# EAGLE design mapleSDuino-Large-V0.1_005 (EAGLE 9.5.1)
MAPLE-CUx Large Version
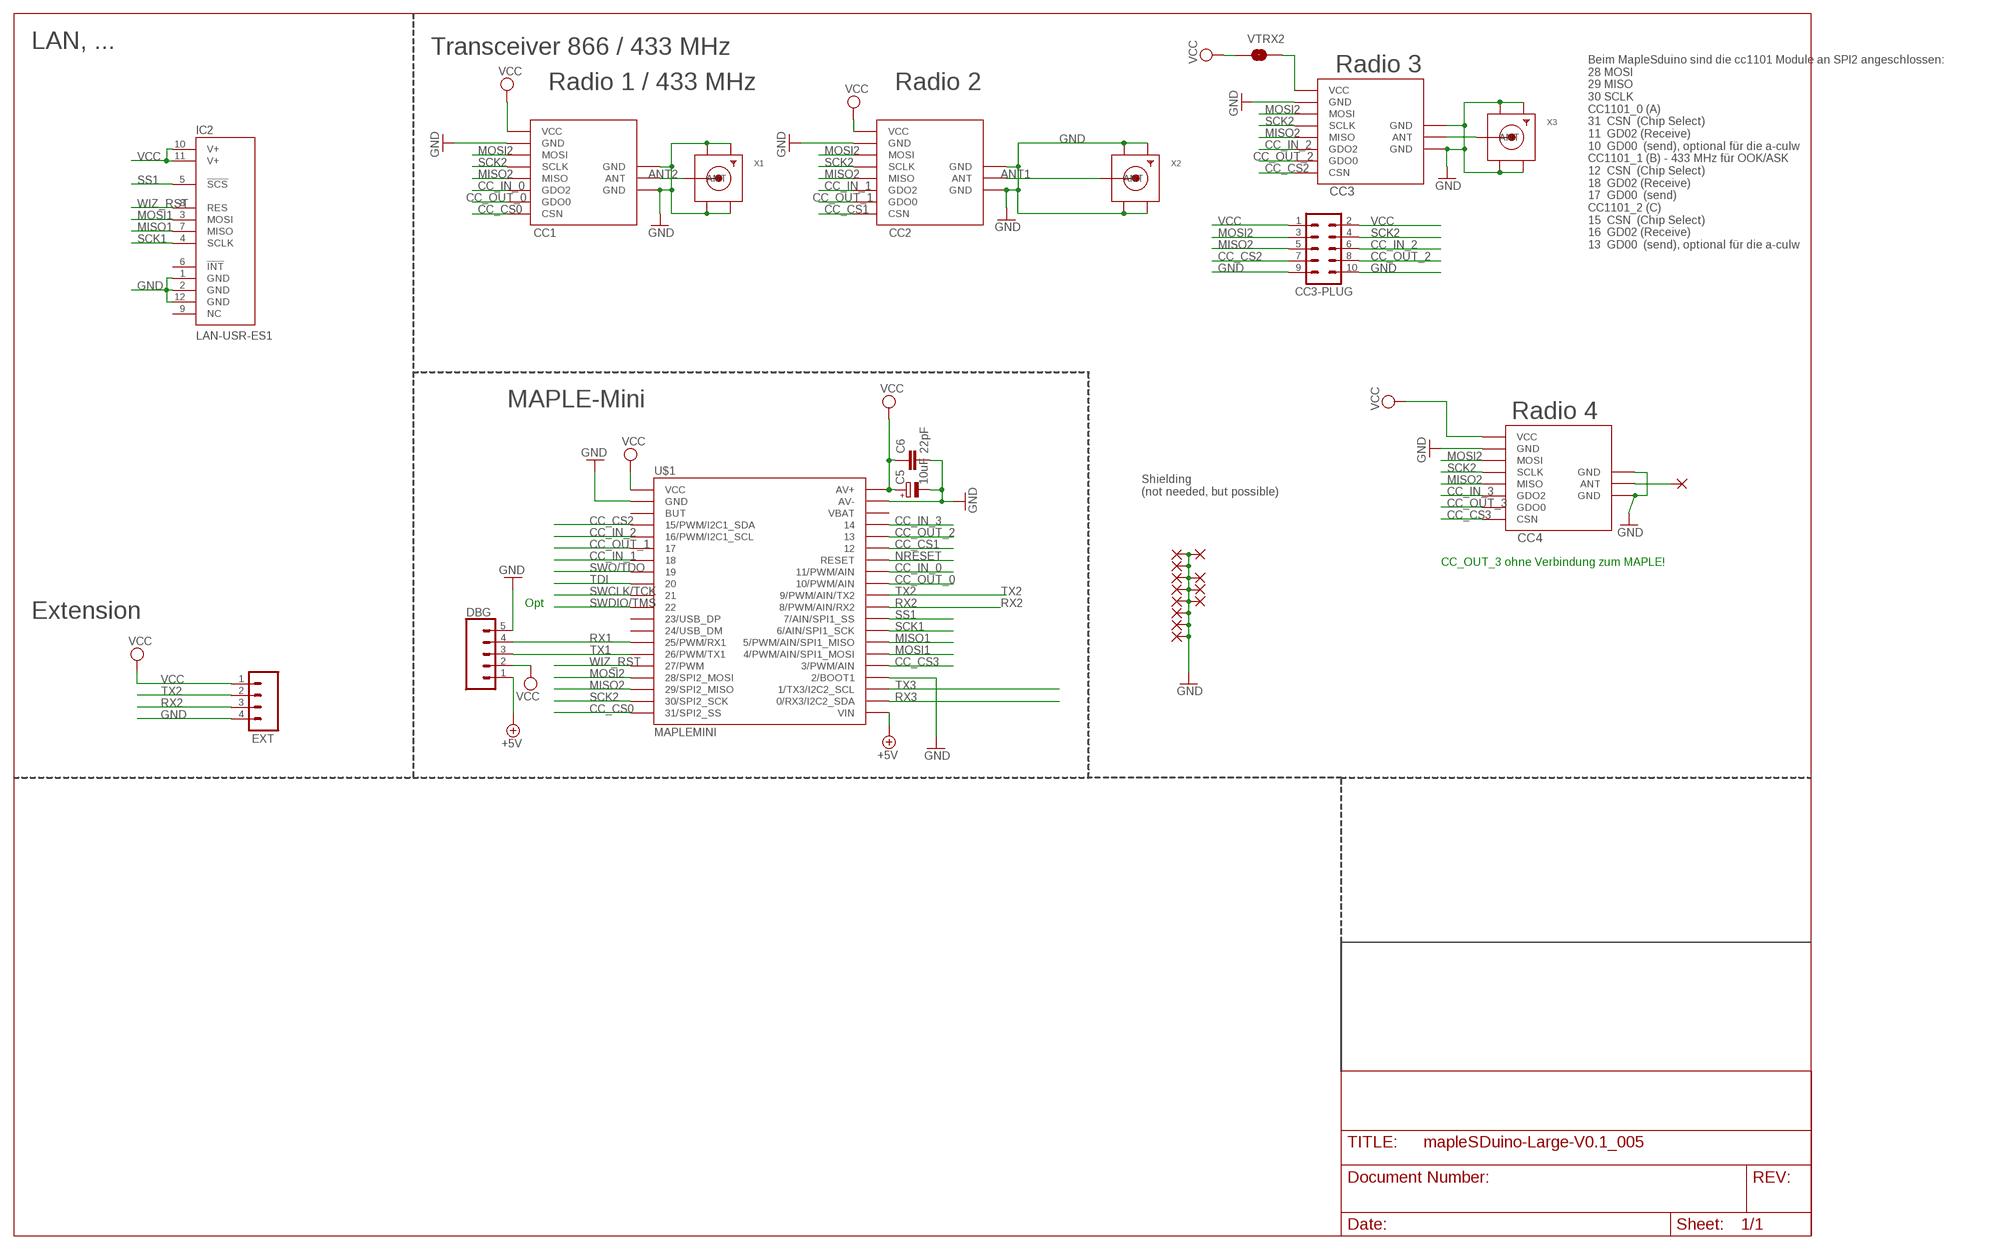
[diagram p0: schematic, sheet 1]

## Parts
C5  10uF  CPOL-EUR/2012-12W  [R/2012-12W]
C6  22pF  C-EUC0805  [C0805]
CC1  CC1101  CC1101_MODULE1SMD  [CC1101_MODULE1_SMD]
CC2  CC1101_MODULE1SMD  [CC1101_MODULE1_SMD]
CC3  CC1101_MODULE1SMD  [CC1101_MODULE1_SMD]
CC3-PLUG  MA05-2  [MA05-2]
CC4  CC1101_MODULE1SMD  [CC1101_MODULE1_SMD]
DBG  CONN_05LOCK  [1X05_LOCK]
EXT  CONN_04PTH  [1X04]
IC2  LAN-USR-ES1  [USR-ES1]
PAD1  WIREPADSMD1,27-254  [SMD1,27-2,54]
PAD2  WIREPADSMD1,27-254  [SMD1,27-2,54]
PAD3  WIREPADSMD1,27-254  [SMD1,27-2,54]
PAD4  WIREPADSMD1,27-254  [SMD1,27-2,54]
PAD5  WIREPADSMD1,27-254  [SMD1,27-2,54]
PAD6  WIREPADSMD1,27-254  [SMD1,27-2,54]
PAD7  WIREPADSMD1,27-254  [SMD1,27-2,54]
PAD8  WIREPADSMD1,27-254  [SMD1,27-2,54]
PAD9  WIREPADSMD1,27-254  [SMD1,27-2,54]
PAD10  WIREPADSMD1,27-254  [SMD1,27-2,54]
PAD11  WIREPADSMD1,27-254  [SMD1,27-2,54]
PAD12  WIREPADSMD1,27-254  [SMD1,27-2,54]
PAD13  WIREPADSMD1,27-254  [SMD1,27-2,54]
U$1  MAPLEMINI  [20-DIP]
VTRX2  JUMPER-SMT_2_NC_TRACE_SILK  [SMT-JUMPER_2_NC_TRACE_SILK]
X1  SMACONNECTOR_EDGE  [SMA_EDGELAUNCH]
X2  SMACONNECTOR_EDGE  [SMA_EDGELAUNCH]
X3  SMACONNECTOR_EDGE  [SMA_EDGELAUNCH]

## Nets
+5V [PWR]: DBG.1 U$1.21(VIN)
ANT1 [PWR]: CC2.ANT X2.P(ANT)
ANT2: CC1.ANT X1.P(ANT)
ANT3: CC3.ANT X3.P(ANT)
CC_CS0: CC1.CSN U$1.20(31/SPI2_SS)
CC_CS1: CC2.CSN U$1.35
CC_CS2: CC3-PLUG.7 CC3.CSN U$1.4(15/PWM/I2C1_SDA)
CC_CS3: CC4.CSN U$1.25(3/PWM/AIN)
CC_IN_0: CC1.GDO2 U$1.33(11/PWM/AIN)
CC_IN_1: CC2.GDO2 U$1.7
CC_IN_2: CC3-PLUG.6 CC3.GDO2 U$1.5(16/PWM/I2C1_SCL)
CC_IN_3: CC4.GDO2 U$1.37
CC_OUT_0: CC1.GDO0 U$1.32(10/PWM/AIN)
CC_OUT_1: CC2.GDO0 U$1.6
CC_OUT_2: CC3-PLUG.8 CC3.GDO0 U$1.36
CC_OUT_3: CC4.GDO0
GND [PWR]: C5.- C6.2 CC1.GND@0(GND) CC1.GND@1(GND) CC1.GND@2(GND) CC2.GND@0(GND) CC2.GND@1(GND) CC2.GND@2(GND) CC3-PLUG.9 CC3-PLUG.10 CC3.GND@0(GND) CC3.GND@1(GND) CC3.GND@2(GND) CC4.GND@0(GND) CC4.GND@1(GND) CC4.GND@2(GND) DBG.5 EXT.4 IC2.1(GND) IC2.2(GND) IC2.12(GND) PAD1.1(P) PAD2.1(P) PAD3.1(P) PAD4.1(P) PAD5.1(P) PAD6.1(P) PAD7.1(P) PAD8.1(P) PAD9.1(P) PAD10.1(P) PAD11.1(P) PAD12.1(P) U$1.2(GND) U$1.24(2/BOOT1) U$1.39(AV-) X1.GND@1(GND4) X1.GND@2(GND3) X1.GND@3(GND2) X1.GND@4(GND1) X2.GND@1(GND4) X2.GND@2(GND3) X2.GND@3(GND2) X2.GND@4(GND1) X3.GND@1(GND4) X3.GND@2(GND3) X3.GND@3(GND2) X3.GND@4(GND1)
MISO1: IC2.7(MISO) U$1.27(5/PWM/AIN/SPI1_MISO)
MISO2: CC1.MISO CC2.MISO CC3-PLUG.5 CC3.MISO CC4.MISO U$1.18(29/SPI2_MISO)
MOSI1: IC2.3(MOSI) U$1.26(4/PWM/AIN/SPI1_MOSI)
MOSI2: CC1.MOSI CC2.MOSI CC3-PLUG.3 CC3.MOSI CC4.MOSI U$1.17(28/SPI2_MOSI)
N$1 [PWR]: CC3.VCC VTRX2.2
N$2: CC4.ANT PAD13.1(P)
NRESET: U$1.34(RESET)
RX1: DBG.4 U$1.14(25/PWM/RX1)
RX2: EXT.3 U$1.30(8/PWM/AIN/RX2)
RX3: U$1.22(0/RX3/I2C2_SDA)
SCK1: IC2.4(SCLK) U$1.28(6/AIN/SPI1_SCK)
SCK2: CC1.SCLK CC2.SCLK CC3-PLUG.4 CC3.SCLK CC4.SCLK U$1.19(30/SPI2_SCK)
SS1: IC2.5(!SCS!) U$1.29(7/AIN/SPI1_SS)
SWCLK/TCK: U$1.10
SWDIO/TMS: U$1.11
SWO/TDO: U$1.8
TDI: U$1.9
TX1: DBG.3 U$1.15(26/PWM/TX1)
TX2: EXT.2 U$1.31(9/PWM/AIN/TX2)
TX3: U$1.23(1/TX3/I2C2_SCL)
VCC [PWR]: C5.+ C6.1 CC1.VCC CC2.VCC CC3-PLUG.1 CC3-PLUG.2 CC4.VCC DBG.2 EXT.1 IC2.10(V+) IC2.11(V+) U$1.1(VCC) U$1.40(AV+) VTRX2.1
WIZ_RST: IC2.8(RES) U$1.16(27/PWM)
Unconnected: IC2.6(!INT!) IC2.9(NC) U$1.3(BUT) U$1.12(23/USB_DP) U$1.13(24/USB_DM) U$1.38(VBAT)

## Notes on the sheet
- LAN, ... | Transceiver 866 / 433 MHz
- Radio 3
- Radio 1 / 433 MHz | Radio 2
- Beim MapleSduino sind die cc1101 Module an SPI2 angeschlossen:
  28 MOSI
  29 MISO
  30 SCLK
  CC1101_0 (A)
  31  CSN  (Chip Select)
  11  GD02 (Receive)
  10  GD00  (send), optional für die a-culw
  CC1101_1 (B) - 433 MHz für OOK/ASK
  12  CSN  (Chip Select)
  18  GD02 (Receive)
  17  GD00  (send)
  CC1101_2 (C)
  15  CSN  (Chip Select)
  16  GD02 (Receive)
  13  GD00  (send), optional für die a-culw
- MAPLE-Mini
- Radio 4
- Shielding
  (not needed, but possible)
- CC_OUT_3 ohne Verbindung zum MAPLE!
- Opt
- Extension

## Library data of the parts
C5 = rcl:CPOL-EU: POLARIZED CAPACITOR, European symbol
C6 = rcl:C-EU: CAPACITOR, European symbol
CC1 CC2 = CC1101:CC1101_MODULE1: CC1101 wireless module for 433/868 MHz (sold from Aliexpress). DIL version for mounting with pin header (and SMD soldering) and SMD only variant available.
CC3 CC4 = wireless:CC1101_MODULE1: CC1101 wireless module for 433/868 MHz (sold from Aliexpress). DIL version for mounting with pin header (and SMD soldering) and SMD only variant available.
CC3-PLUG = con-lstb:MA05-2: PIN HEADER; OC_FARNELL: unknown; OC_NEWARK: unknown
DBG = SparkFun-Connectors:CONN_05: Multi connection point. Often used as Generic Header-pin footprint for 0.1 inch spaced/style header connections On any of the 0.1 inch spaced packages, you can populate with these: Break Away Headers - Straight <https://www.sparkfun.com/products/116> (PRT-00116) Break Away Male Headers - Right Angle <https://www.sparkfun.com/products/553> (PRT-00553) Female Headers <https://www.sparkfun.com/products/115> (PRT-00115) Break Away Headers - Machine Pin <https://www.sparkfun.com/products/117> (PRT-00117) Break Away Female Headers - Swiss Machine Pin <https://www.sparkfun.com/products/743> (PRT-00743) For SCREWTERMINALS and SPRING TERMINALS visit here: Screw Terimnals on SparkFun.com <https://www.sparkfun.com/search/results?term=Screw+Terminals> (5mm/3.5mm/2.54mm spacing) This device is also useful as a general connection point to wire up your design to another part of your project. Our various solder wires solder well into these plated through hole pads. Hook-Up Wire - Assortment (Stranded, 22 AWG) <https://www.sparkfun.com/products/11375> (PRT-11375) Hook-Up Wire - Assortment (Solid Core, 22 AWG) <https://www.sparkfun.com/products/11367> (PRT-11367) View the entire wire category on our website here <https://www.sparkfun.com/categories/141> Special notes: Molex polarized connector foot print use with SKU : PRT-08231 with associated crimp pins and housings. 1MM SMD Version SKU: PRT-10208
EXT = SparkFun-Connectors:CONN_04: Multi connection point. Often used as Generic Header-pin footprint for 0.1 inch spaced/style header connections On any of the 0.1 inch spaced packages, you can populate with these: Break Away Headers - Straight <https://www.sparkfun.com/products/116> (PRT-00116) Break Away Male Headers - Right Angle <https://www.sparkfun.com/products/553> (PRT-00553) Female Headers <https://www.sparkfun.com/products/115> (PRT-00115) Break Away Headers - Machine Pin <https://www.sparkfun.com/products/117> (PRT-00117) Break Away Female Headers - Swiss Machine Pin <https://www.sparkfun.com/products/743> (PRT-00743) For SCREWTERMINALS and SPRING TERMINALS visit here: Screw Terimnals on SparkFun.com <https://www.sparkfun.com/search/results?term=Screw+Terminals> (5mm/3.5mm/2.54mm spacing) This device is also useful as a general connection point to wire up your design to another part of your project. Our various solder wires solder well into these plated through hole pads. Hook-Up Wire - Assortment (Stranded, 22 AWG) <https://www.sparkfun.com/products/11375> (PRT-11375) Hook-Up Wire - Assortment (Solid Core, 22 AWG) <https://www.sparkfun.com/products/11367> (PRT-11367) View the entire wire category on our website here <https://www.sparkfun.com/categories/141> Special notes: Molex polarized connector foot print use with SKU : PRT-08231 with associated crimp pins and housings. 1MM SMD Version SKU: PRT-10208; PROD_ID: CONN-09696
IC2 = Martin-Communication:LAN-USR-ES1
PAD1-PAD13 = wirepad:WIREPAD: Wire PAD connect wire on PCB
U$1 = maplemini-small:MAPLEMINI
VTRX2 = SparkFun-Jumpers:JUMPER-SMT_2_NC_TRACE: Normally closed trace jumper This jumper has a trace between two pads so it's normally closed (NC). Use a razor knife to open the connection. For best results follow the IPC guidelines for cutting traces: Cutout at least 0.063 mm (0.005 in). Remove all loose material to clean up the cut area. Seal the cut with an approved epoxy. Reapply solder to reclose the connection.
X1-X3 = adafruit:SMACONNECTOR: SMA Connector 90° DIP SMA Connector, 50 Ohm (4UConnector: 07259)

## Net classes
0 default: width 0.305 mm
1 PWR: width 0.406 mm

## Board
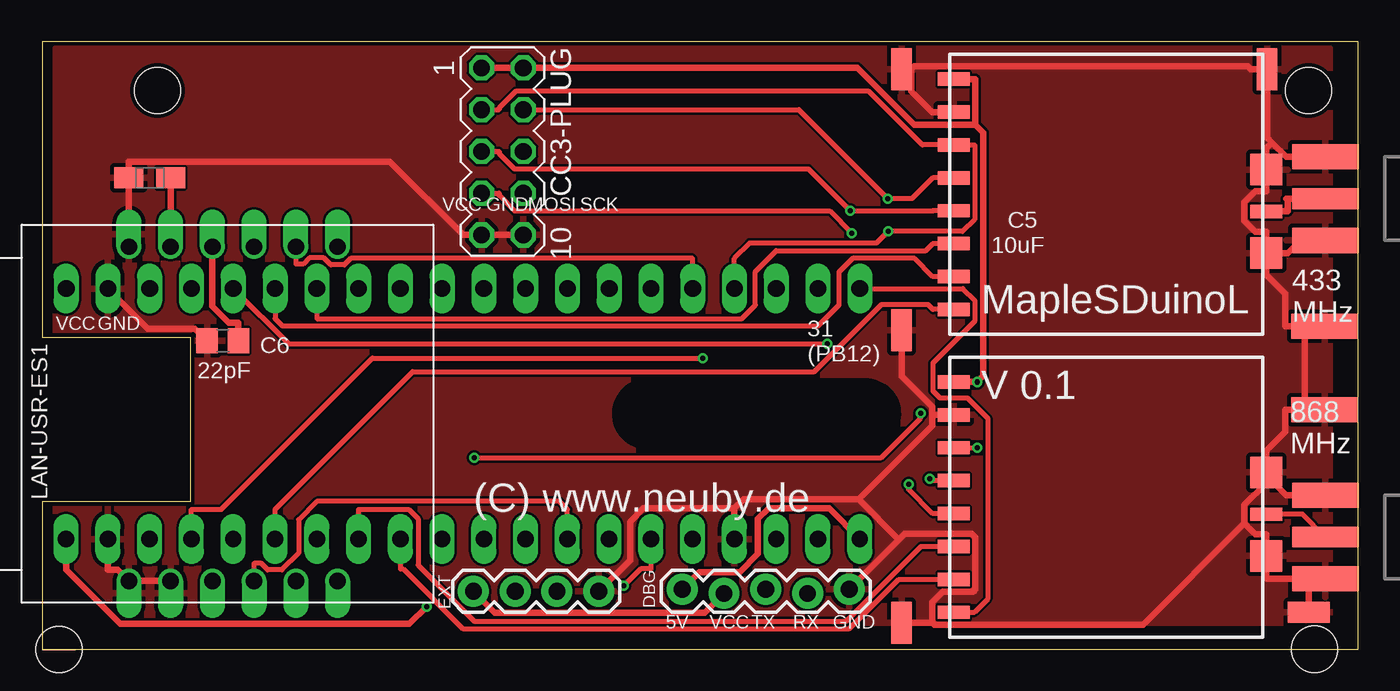
[diagram p1: board, top side]
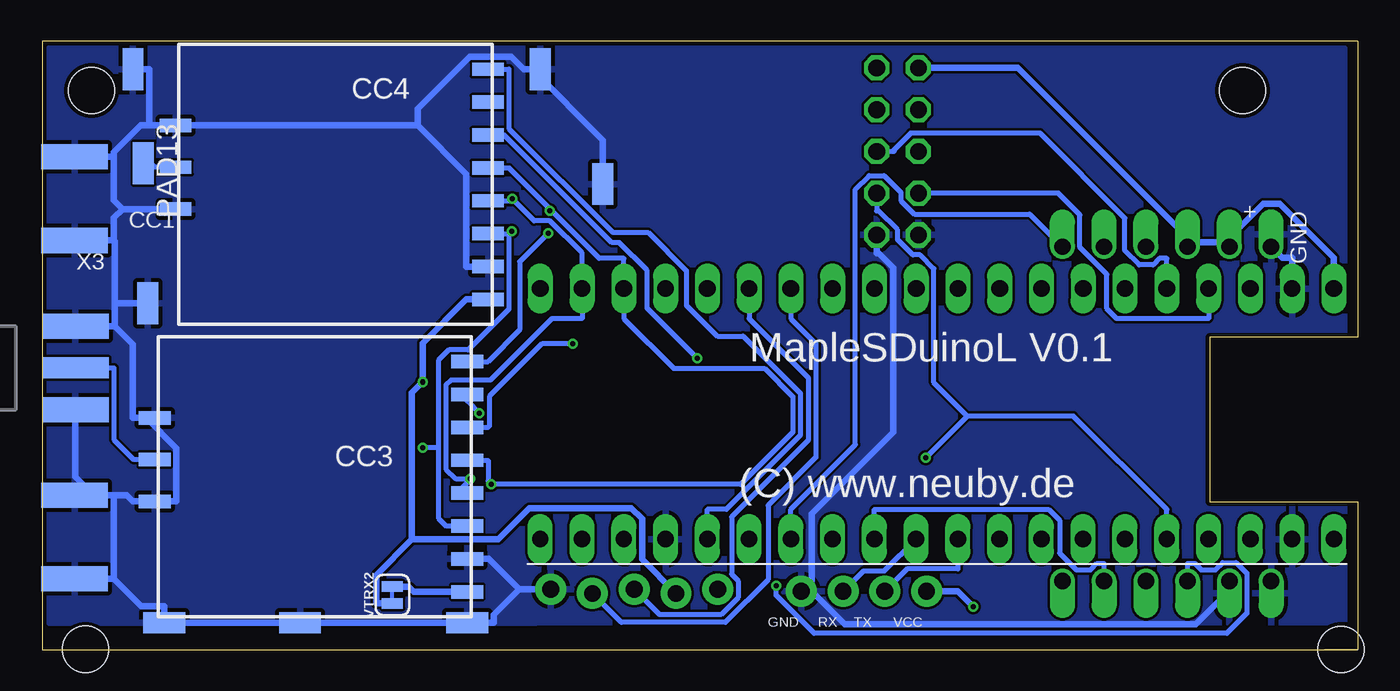
[diagram p2: board, bottom side, seen from below]

Size 80 x 37 mm. Coordinates in mm from the lower left corner, seen from the top.
Outline: 2,0 80,0 80,37 0,37 0,19 9,19 9,9 0,9 0,0
Outline: 2,0 1,0 0,0
Outline: 0,0 2,0
Copper layers (1*16): Top 0.035mm / dielectric 1.5mm / Bottom 0.035mm
Design rules "Fusion_eagle_rule_v1.1": minimum track width 6mil, minimum drill 12mil, track to track 6mil, track to pad 6mil, pad to pad 6mil, via to via 6mil, smd to smd 0mil, copper to edge 10mil, drill to drill 10mil, minimum pad ring 10mil, minimum via ring 6mil, stop-mask expansion 2mil, vias tented up to drill 100mil, thermal gap 10mil
Holes 2.8 mm at 1,0 77,34 77.35,0.02 7,34
tRestrict: 8 lines
bRestrict: 6 lines

### Footprints (pad centres in the part's own frame; a part is rotated, then mirrored left to right if it is on the bottom)
R/2012-12W = smd 1.75 x 1.26: + 1.275,0; - -1.275,0
C0805 = smd 1.3 x 1.5: 1 -0.95,0; 2 0.95,0
CC1101_MODULE1_SMD = smd 1.93 x 0.813: ANT 19,5.96; CSN 0,0; GDO0 0,2; GDO2 0,4; GND@0 0,12; MISO 0,6; MOSI 0,10; SCLK 0,8; VCC 0,14 | smd 1.93 x 1.905: GND@1 19,8.5; GND@2 19,3.42
CC1101_MODULE1_SMD' = smd 1.93 x 0.813: ANT 19,5.96; CSN 0,0; GDO0 0,2; GDO2 0,4; GND@0 0,12; GND@1 19,8.5; GND@2 19,3.42; MISO 0,6; MOSI 0,10; SCLK 0,8; VCC 0,14
MA05-2 = drill 1.016 octagon: 1 -5.08,-1.27; 2 -5.08,1.27; 3 -2.54,-1.27; 4 -2.54,1.27; 5 0,-1.27; 6 0,1.27; 7 2.54,-1.27; 8 2.54,1.27; 9 5.08,-1.27; 10 5.08,1.27
1X05_LOCK = drill 1.016 pad 1.88: 1 0,0.127; 2 2.54,-0.127; 3 5.08,0.127; 4 7.62,-0.127; 5 10.16,0.127
1X04 = drill 1.016 pad 1.88: 1 0,0; 2 2.54,0; 3 5.08,0; 4 7.62,0
USR-ES1 = drill 1 pad 1.35 offset: 1 -10.16,5.715; 2 -10.16,3.175; 3 -10.16,0.635; 4 -10.16,-1.905; 5 -10.16,-4.445; 6 -10.16,-6.985; 7 10.16,-6.985; 8 10.16,-4.445; 9 10.16,-1.905; 10 10.16,0.635; 11 10.16,3.175; 12 10.16,5.715
SMD1,27-2,54 = smd 1.27 x 2.54: 1 0,0
20-DIP = drill 1.016 pad 1.27 long: 1 -24.13,-7.62; 2 -21.59,-7.62; 3 -19.05,-7.62; 4 -16.51,-7.62; 5 -13.97,-7.62; 6 -11.43,-7.62; 7 -8.89,-7.62; 8 -6.35,-7.62; 9 -3.81,-7.62; 10 -1.27,-7.62; 11 1.27,-7.62; 12 3.81,-7.62; 13 6.35,-7.62; 14 8.89,-7.62; 15 11.43,-7.62; 16 13.97,-7.62; 17 16.51,-7.62; 18 19.05,-7.62; 19 21.59,-7.62; 20 24.13,-7.62 | drill 1 pad 1.27 long: 21 24.13,7.62; 22 21.59,7.62; 23 19.05,7.62; 24 16.51,7.62; 25 13.97,7.62; 26 11.43,7.62; 27 8.89,7.62; 28 6.35,7.62; 29 3.81,7.62; 30 1.27,7.62; 31 -1.27,7.62; 32 -3.81,7.62; 33 -6.35,7.62; 34 -8.89,7.62; 35 -11.43,7.62; 36 -13.97,7.62; 37 -16.51,7.62; 38 -19.05,7.62; 39 -21.59,7.62; 40 -24.13,7.62
SMT-JUMPER_2_NC_TRACE_SILK = smd 0.635 x 1.27: 1 -0.508,0; 2 0.508,0
SMA_EDGELAUNCH = smd 4.064 x 1.524: GND@1 2.032,-2.54; GND@2 2.032,2.54 | smd 4.064 x 1.524 bottom: GND@3 2.032,2.54; GND@4 2.032,-2.54 | smd 4.064 x 1.27: P 2.032,0

### Placement (x,y rotation side)
C5  6.53,28.69 0 top
C6  10.97,18.78 180 top
CC1  55.42,2.27 0 top
CC2  55.42,20.68 0 top
CC3  CC1101_MODULE1SMD  [CC1101_MODULE1_SMD']  54.15,17.51 180 bottom
CC3-PLUG  27.98,30.29 270 top
CC4  CC1101_MODULE1SMD  [CC1101_MODULE1_SMD']  52.88,35.29 180 bottom
DBG  38.91,3.54 0 top
EXT  26.21,3.54 0 top
IC2  10.97,14.34 90 top
PAD1  52.24,19.41 0 top
PAD2  77.01,2.27 90 top
PAD3  52.24,35.29 180 top
PAD4  72.56,1.64 270 bottom
PAD5  74.47,35.29 180 top
PAD6  52.24,1.64 0 top
PAD7  64.31,1.64 270 bottom
PAD8  54.15,1.64 270 bottom
PAD9  73.58,21.07 180 bottom
PAD10  74.47,35.29 0 bottom
PAD11  45.9,28.3 180 bottom
PAD12  49.7,35.29 180 bottom
PAD13  73.83,29.57 180 bottom
U$1  25.57,14.34 180 bottom
VTRX2  58.7,3.32 90 bottom
X1  80.06,6.84 180 top
X2  80.06,27.42 180 top
X3  80,17.13 0 bottom

### Tracks (layer width: path | path; a pad name or v marks a point on that pad's centre or on a via)
+5V
  Top 0.406: U$1.21 47.84,8.58 44.16,8.58 43.52,7.94 43.52,5.82 42.4,4.71 39.95,4.71 DBG.1
ANT1
  Top 0.406: CC2.ANT 75.74,26.64 75.74,27.31 75.64,27.42 X2.P
ANT2
  Top 0.305: X1.P 76.64,8.23 CC1.ANT
ANT3
  Bottom 0.305: CC3.ANT 74.42,11.55 75.63,12.76 75.63,17.13 X3.P
CC_CS0
  Top 0.305: CC1.CSN 56.69,2.27 57.48,3.06 57.48,14.07 56.25,15.31 54.58,15.31 54.15,15.74 54.15,17.41 56.69,19.95 56.69,21.25 55.98,21.95 U$1.20
CC_CS1
  Top 0.305: CC2.CSN 54.15,20.68 53.84,20.99 51.03,20.99 46.94,16.9 22.52,16.9 14.14,8.53 U$1.35
CC_CS2  (via drill 0.3 pad 0.61)
  Top 0.305: CC3-PLUG.7 27.77,27.75 27.77,27.62 28.71,26.68 47.87,26.68 v49.23,25.32
  Bottom 0.305: v49.23,25.32 50.96,23.59 50.96,19.43 52.88,17.51 CC3.CSN | U$1.4 9.06,20.13 14.65,20.13 15.25,20.73 15.25,22.82 16.89,24.45 16.89,26.44 18.2,27.75 CC3-PLUG.7
CC_CS3
  Bottom 0.305: U$1.25 39.55,8.53 38.38,8.53 33.88,13.03 33.88,15.57 37.36,19.06 38.94,19.06 40.81,20.94 40.81,23.04 43.14,25.36 45.29,25.36 51.61,31.68 51.61,35.29 CC4.CSN
CC_IN_0
  Top 0.305: U$1.33 19.23,8.53 22.27,8.53 22.85,7.95 22.85,5.13 26.26,1.73 48.89,1.73 53.43,6.27 CC1.GDO2
CC_IN_1
  Top 0.305: CC2.GDO2 54.15,24.68 53.72,24.25 44.63,24.25 43.35,22.98 43.35,20.94 42.54,20.13 16.68,20.13 U$1.7
CC_IN_2  (via drill 0.3 pad 0.61)
  Top 0.305: U$1.5 14.98,18.58 v47.73,18.58
  Bottom 0.305: v47.73,18.58 49.6,18.58 52.79,15.39 52.79,13.6 52.88,13.51 CC3.GDO2 | CC3-PLUG.6 28.18,30.29 28.18,30.4 27.18,31.4 19.3,31.4 14.14,26.24 14.14,24.25 13.29,23.39 12.44,23.39 12.05,23.78 11.61,23.78 U$1.5
CC_IN_3  (via drill 0.3 pad 0.61)
  Top 0.305: v40.16,17.72 20.07,17.72 10.88,8.53 9.06,8.53 U$1.37
  Bottom 0.305: v40.16,17.72 43.2,20.76 43.2,23.06 44.89,24.74 45.34,24.74 51.89,31.29 CC4.GDO2
CC_OUT_0
  Top 0.305: CC1.GDO0 52.08,4.27 49.08,1.27 25.57,1.27 21.93,4.9 21.77,4.9 U$1.32
CC_OUT_1
  Top 0.305: CC2.GDO0 54.15,22.68 53.05,23.79 49.27,23.79 48.44,22.96 48.44,20.94 47.16,19.67 14.6,19.67 14.14,20.13 U$1.6
CC_OUT_2  (via drill 0.3 pad 0.61)
  Top 0.305: v26.25,11.68 51.01,11.68 53.4,14.07 v53.4,14.37
  Bottom 0.305: CC3.GDO0 54.15,15.12 v53.4,14.37 | 23.72,14.2 v26.25,11.68 | 23.72,14.2 25.76,16.24 25.76,23.16 26.6,24 27.05,24 27.98,24.93 27.98,25.52 29.14,26.68 29.25,26.68 CC3-PLUG.8 | 23.72,14.2 17.28,14.2 11.61,8.53 U$1.36
GND
  Top 0.406: EXT.4 35.73,5.45 35.73,7.78 36.54,8.58 42.09,8.58 | U$1.24 42.09,8.58 | 52.09,6.68 49.63,9.14 | 49.63,9.14 42.65,9.14 42.09,8.58 | 49.63,9.14 54.1,13.61 54.1,14.27 | PAD1.1 52.24,16.62 54.1,14.77 54.1,14.27 | CC1.GND@0 54.1,14.27 | 52.09,6.68 DBG.5 | 54.1,1.64 54.1,2.86 54.74,3.51 56.59,3.51 56.74,3.65 56.74,6.83 56.52,7.05 52.45,7.05 52.09,6.68 | 54.1,1.64 54.23,1.51 66.94,1.51 73.1,7.67 | 54.1,1.64 53.24,1.64 PAD6.1 | 73.1,7.67 73.77,7 74.42,7 CC1.GND@2 74.42,4.38 74.5,4.3 76.83,4.3 | 74.42,10.12 73.1,8.79 73.1,7.67 | 74.42,10.12 74.9,10.12 75.64,9.38 X1.GND@1 | CC3-PLUG.10 CC3-PLUG.9 25.59,25.21 21.13,29.67 5.25,29.67 C5.- 5.25,27.12 5.26,27.11 IC2.12 | CC2.GND@2 74.42,25.41 73.77,25.41 73.1,26.08 73.1,27.21 73.77,27.88 74.42,27.88 CC2.GND@1 74.42,30.49 74.76,30.83 | CC2.GND@2 75.08,24.11 75.74,24.11 76.51,24.88 X2.GND@2 | PAD2.1 77.01,4.12 76.83,4.3 | U$1.2 6.42,19.52 9.28,19.52 C6.2 | X1.GND@2 76.83,4.3 | 74.76,30.83 74.47,31.12 PAD10.1 73.48,35.29 73.3,35.47 53.01,35.47 52.83,35.29 | 74.76,30.83 75.64,29.96 75.78,29.96 X2.GND@1 | IC2.2 IC2.1 4.58,4.85 3.99,4.85 U$1.39 | 74.42,10.12 CC1.GND@1 74.42,12.08 75.58,13.24 75.58,14.59 76.77,14.59 | 52.83,35.29 52.83,33.95 54.1,32.69 CC2.GND@0 | 52.83,35.29 52.74,35.29 PAD3.1 | X3.GND@4 76.77,14.59 | 76.77,19.67 75.58,19.67 75.58,21.64 74.42,22.8 CC2.GND@2 | X3.GND@3 76.77,19.67 | 76.77,19.67 76.77,14.59
  Bottom 0.406: 50.2,35.29 45.9,30.98 PAD11.1 | 50.2,35.29 50.7,35.29 51.47,36.06 53.99,36.06 57.16,32.9 57.16,31.87 | PAD12.1 50.2,35.29 | 57.16,31.87 54.2,28.91 54.2,23.29 CC4.GND@0 | 57.16,31.87 70.56,31.87 71.22,31.87 CC4.GND@2 72.54,31.87 73.48,31.87 | 50.99,3.67 52.83,5.51 CC3.GND@0 | DBG.5 50.99,3.67 | 50.99,3.67 52.52,2.13 52.52,1.64 PAD8.1 PAD7.1 70.94,1.64 PAD4.1 72.56,2.63 73.96,2.63 75.64,4.3 | 73.48,31.87 74,31.87 75.64,30.23 75.64,29.96 | 73.48,31.87 73.48,35.29 PAD10.1 | 75.09,26.79 75.64,26.24 75.64,24.88 | 75.09,26.79 73.2,26.79 CC4.GND@1 | 75.64,29.96 75.64,27.34 75.09,26.79 | X2.GND@1 75.64,29.96 | 33.51,3.86 33.2,4.17 33.2,8.25 28.23,13.21 28.23,23.21 29.12,24.09 29.25,24.09 CC3-PLUG.10 | EXT.4 33.51,3.86 | 33.51,3.86 31.19,1.54 9.83,1.54 7.79,3.57 IC2.2 | 73.67,14.09 71.83,12.25 71.83,9.01 CC3.GND@1 74.47,9.01 74.84,9.38 75.64,9.38 | 73.67,14.09 74.47,14.09 74.47,18.56 75.58,19.67 | CC3.GND@2 73.67,14.09 | 75.58,21.07 75.58,19.67 | U$1.2 3.99,23.84 4.59,23.84 IC2.12 | 76.83,9.38 75.64,9.38 | X1.GND@2 75.64,4.3 | 75.64,4.3 75.64,9.38 | X3.GND@4 77.97,10.52 76.83,9.38 | X1.GND@1 76.83,9.38 | 75.58,21.07 75.58,24.82 75.64,24.88 | 75.58,21.07 74.57,21.07 PAD9.1 | X3.GND@3 75.58,19.67 | X2.GND@2 75.64,24.88
  pour Bottom: 79.55,36.56 0.81,36.56 0.81,1.64 79.55,1.64
  pour Top: 0.81,1.64 0.81,36.56 78.28,36.56 78.28,1.64
MISO1
  Bottom 0.305: U$1.27 34.47,8.53 30.53,12.46 30.53,27.99 29.71,28.82 28.79,28.82 27.77,27.8 27.77,27.3 26.96,26.48 19.94,26.48 IC2.7
MISO2  (via drill 0.3 pad 0.61)
  Top 0.305: v52.68,10.04 52.68,9.74 54.15,8.27 CC1.MISO | CC3-PLUG.5 27.77,30.29 27.77,30.16 28.71,29.22 46.58,29.22 v49.12,26.68 54.15,26.68 CC2.MISO
  Bottom 0.305: CC3.MISO 52.88,11.51 52.88,10.24 v52.68,10.04 37.52,10.04 34.34,13.22 34.34,15.39 36.05,17.1 41.6,17.1 44.62,20.13 44.62,21.93 U$1.18 44.62,23.78 46.12,23.78 49.02,26.68 v49.12,26.68 49.12,26.8 51.61,29.29 CC4.MISO
MOSI1  (via drill 0.3 pad 0.61)
  Top 0.305: v35.36,3.88 36.39,4.9 37.01,4.9 U$1.26
  Bottom 0.305: v35.36,3.88 35.36,3.3 33.06,0.99 7.95,0.99 6.73,2.21 6.73,4.64 7.38,5.29 8.21,5.29 8.65,4.85 9.51,4.85 9.9,5.23 10.34,5.23 IC2.3
MOSI2  (via drill 0.3 pad 0.61)
  Top 0.305: v56.84,12.27 56.69,12.27 CC1.MOSI | U$1.17 42.09,23.78 43.01,24.71 50.72,24.71 v51.43,25.42 55.97,25.42 56.69,26.15 56.69,30.68 CC2.MOSI 53.51,30.68 50.25,33.94 28.77,33.94 27.77,32.94 27.77,32.83 CC3-PLUG.3
  Bottom 0.305: 55.9,12.27 55.9,7.99 55.42,7.51 CC3.MOSI | 51.61,25.29 51.61,20.7 54.09,18.23 55.25,18.23 55.9,17.58 55.9,12.27 | 55.9,12.27 v56.84,12.27 | 51.61,25.29 51.57,25.29 v51.43,25.42 | CC4.MOSI 51.61,25.29
N$1
  Bottom 0.406: VTRX2.2 57.7,3.83 57.39,3.51 55.47,3.51 CC3.VCC
N$2
  Bottom 0.305: CC4.ANT 73.15,29.33 73.39,29.57 PAD13.1
RX1
  Bottom 0.305: DBG.4 44.78,1.66 38.44,1.66 35.85,4.25 35.85,8.77 32.94,11.68 32.94,18.6 34.47,20.13 U$1.14
RX2
  Bottom 0.305: EXT.3 30.05,4.79 28.77,4.79 U$1.30
SCK1
  Top 0.305: IC2.4 12.88,5.23 13.31,5.23 13.7,4.85 14.56,4.85 15.58,5.87 15.58,7.9 16.69,9.01 31.44,9.01 31.92,8.53 U$1.28
SCK2  (via drill 0.3 pad 0.61)
  Top 0.305: v51.42,27.41 | v51.42,27.41 52.88,27.41 54.15,28.68 CC2.SCLK | CC3-PLUG.4 46,32.83 v51.42,27.41 | v53.97,10.39 54.09,10.27 54.15,10.27 CC1.SCLK
  Bottom 0.305: CC4.SCLK 52.24,27.29 51.54,27.29 v51.42,27.41 50.08,26.07 49.11,26.07 47.16,24.12 47.16,23.78 47.16,22.87 U$1.19 47.16,20.13 48.99,20.13 52.74,16.38 55.13,16.38 55.44,16.07 55.44,10.97 54.85,10.39 v53.97,10.39 53.97,10.32 54.78,9.51 CC3.SCLK
SS1
  Bottom 0.305: IC2.5 15.41,5.23 15.85,5.23 16.24,4.85 17.1,4.85 18.12,5.87 18.12,7.86 18.79,8.53 29.38,8.53 U$1.29
TX1
  Bottom 0.305: U$1.15 37.01,20.13 33.39,16.51 33.39,12.74 38.06,8.07 38.06,4.58 37.66,4.18 37.66,3.15 38.7,2.12 42.44,2.12 DBG.3
TX2
  Bottom 0.305: U$1.31 24.3,4.9 27.39,4.9 EXT.2
VCC  (via drill 0.3 pad 0.61)
  Top 0.406: 56.74,31.9 56.74,34.69 CC2.VCC | 56.74,31.9 57.22,31.42 57.22,16.64 v56.85,16.27 56.74,16.27 CC1.VCC | 56.74,31.9 53.01,31.9 49.54,35.37 CC3-PLUG.2 CC3-PLUG.1 | IC2.11 7.79,27.11 7.8,27.12 C5.+ | v23.37,2.6 22.32,1.55 4.74,1.55 1.45,4.85 U$1.40 | C6.1 11.92,19.89 11.32,19.89 10.34,20.87 IC2.10 | EXT.1 27.51,2.24 40.28,2.24 DBG.2
  Bottom 0.406: 57.51,6.69 57.51,15.62 v56.85,16.27 56.85,18.64 54.2,21.29 CC4.VCC | 57.51,6.69 52.27,6.69 50.38,8.59 44.16,8.59 43.52,7.95 43.52,5.48 DBG.2 | 57.51,6.69 59.69,4.51 59.69,2.81 VTRX2.1 | 7.79,24.77 IC2.11 | 7.79,24.77 7.79,25.05 5.73,27.12 4.73,27.12 1.45,23.84 U$1.1 | 10.34,24.77 IC2.10 | CC3-PLUG.1 20.66,35.37 10.34,25.05 10.34,24.77 | 10.34,24.77 7.79,24.77 | EXT.1 24.31,3.54 v23.37,2.6
WIZ_RST
  Top 0.305: IC2.8 15.41,23.44 15.85,23.44 16.24,23.82 17.11,23.82 17.54,23.39 18.37,23.39 18.76,23.78 39.55,23.78 U$1.16

### Text on the board
tNames: VCC | GND | MOSI | SCK | C5 | 10uF | 31 / (PB12) | 433 / MHz | VCC | GND | C6 | 22pF | MapleSDuinoL | V 0.1 | 868 / MHz | LAN-USR-ES1 | (C) www.neuby.de | 5V | VCC | TX | RX | GND
bNames: GND | + | CC1 | MapleSDuinoL V0.1 | (C) www.neuby.de | VCC | TX | RX | GND